# Altium schematic sheet 降压模块.SchDoc
size A4
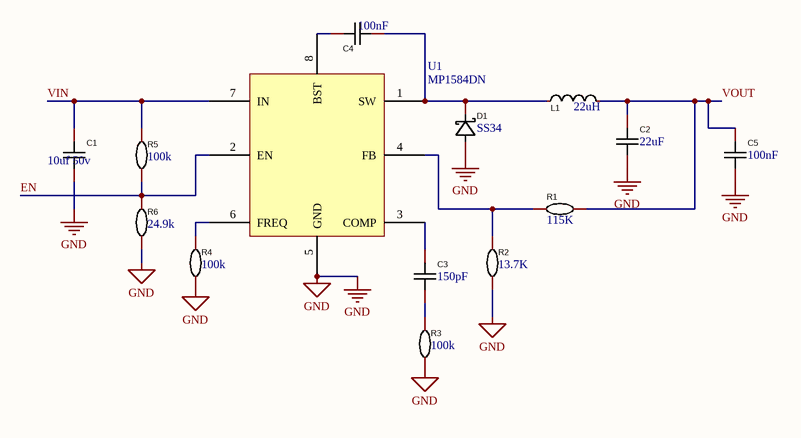
[diagram p0: 降压模块.SchDoc]

## Parts
C1  10uf 50v  [C1206]
C2  22uF  [C1206]
C3  150pF  [R0603]
C4  100nF  [R0603]
C5  100nF  [R0603]
D1  SS34  [ss34  SMA_L4.3-W2.5-LS5.0-RD]
L1  22uH  [功率电感15uh]
R1  115K  [R0603]
R2  13.7K  [R0603]
R3  100k  [R0603]
R4  100k  [R0603]
R5  100k  [R0603]
R6  24.9k  [R0603]
U1  MP1584DN  [LC-SOIC-8_EP_150mil]

## Nets
GND: C1.1 C2.1 C5.1 D1.2(A) R2.1 R3.1 R4.1 R6.1 U1.5(GND)
EN: R5.1 R6.2 U1.2(EN)
VIN: C1.2 R5.2 U1.7(IN)
VOUT: C2.2 C5.2 L1.2 R1.1
NetC3_1: C3.1 R3.2
NetC3_2: C3.2 U1.3(COMP)
NetC4_1: C4.1 U1.8(BST)
NetC4_2: C4.2 D1.1(C) L1.1 U1.1(SW)
NetR1_2: R1.2 R2.2 U1.4(FB)
NetR4_2: R4.2 U1.6(FREQ)

## Library data of the parts
C1 C3-C5 = 电容22uf 6.3v x7r: 型号： CGA5L1X7R0J226MT0Y0E / 品牌： TDK / 封装： 1206 / 描述：容值：22uF 精度：±20% 额定电压：6.3V 材质(温度系数)：X7R; Name: 22uF; Add into BOM: yes; Value: 22uF; Tolerance: ±20%; Voltage Rated: 6.3V; Temperature Coefficient: X7R; Symbol: CGA5L1X7R0J226MT0Y0E; Device: CGA5L1X7R0J226MT0Y0E; LCSC Part Name: 22uF ±20% 6.3V; Supplier Part: C342630; Manufacturer: TDK; Manufacturer Part: CGA5L1X7R0J226MT0Y0E; Supplier Footprint: 1206; JLCPCB Part Class: Extended Part; Datasheet: https://atta.szlcsc.com/upload/public/pdf/source/20190716/C342630_ADB15E5CCD286B86322CE8B53B7BBFDA.pdf; Supplier: LCSC; Convert to PCB: yes
C2 = 电容22uf 6.3v x7r: 1206; Manufacturer: TDK; Symbol: CGA5L1X7R0J226MT0Y0E; Add into BOM: yes; Tolerance: ±20%; Voltage Rated: 6.3V; Temperature Coefficient: X7R; Name: 22uF; Device: CGA5L1X7R0J226MT0Y0E; LCSC Part Name: 22uF ±20% 6.3V; Supplier Part: C342630; Manufacturer Part: CGA5L1X7R0J226MT0Y0E; Supplier Footprint: 1206; JLCPCB Part Class: Extended Part; Datasheet: https://atta.szlcsc.com/upload/public/pdf/source/20190716/C342630_ADB15E5CCD286B86322CE8B53B7BBFDA.pdf; Supplier: LCSC; Convert to PCB: yes; Value: 22uF
D1 = SS34: 型号： SS34 品牌： TWGMC(台湾迪嘉) 封装： SMA 二极管配置：独立式 直流反向耐压(Vr)：40V 平均整流电流(Io)：3A 正向压降(Vf)：550mV@3A 二极管配置：独立式 直流反向耐压(Vr)：40V 平均整流电流(Io)：3A 正向压降(Vf)：950mV@3A; Symbol: SS34_C727060; Add into BOM: yes; Diode Configuration: 独立式; Reverse Voltage (Vr): 40V; Average Rectified Current (Io): 3A; Reverse Leakage Current (Ir): 500uA@40V; Name: SS34; Device: SS34_C727060; LCSC Part Name: 40V 3A 550mV@3A; Supplier Part: C727060; Manufacturer: TWGMC(台湾迪嘉); Manufacturer Part: SS34; Supplier Footprint: SMA; JLCPCB Part Class: Extended Part; Datasheet: https://atta.szlcsc.com/upload/public/pdf/source/20200828/C727059_6599B6CAC5F3238B9C33E46794659DBE.pdf; Supplier: LCSC; Convert to PCB: yes; Forward Voltage (Vf@If): 550mV@3A
L1 = 功率电感 15uh: 能装上就行; Manufacturer: Sunlord(顺络); Manufacturer Part: MWSA1004S-150MT; Name: 15uH; Symbol: MWSA1004-150MT; Device: MWSA1004S-150MT_C151872; Add into BOM: yes; Value: 15uH; Tolerance: ±20%; Rated Current: 6.5A; Saturation Current (Isat): 7A; DC Resistance (DCR): 45mΩ; LCSC Part Name: 15uH ±20% 7A; Supplier Part: C151872; Supplier Footprint: SMD; JLCPCB Part Class: Extended Part; Datasheet: https://atta.szlcsc.com/upload/public/pdf/source/20180327/C151872_2907C77BE933212C728C209604192B1D.pdf; Supplier: LCSC; Convert to PCB: yes; Type: -; Ratings: -
R1-R6 = res: Manufacturer: FH(风华); Name: 210kΩ; Symbol: RS-03K2103FT; Add into BOM: yes; Value: 210kΩ; Tolerance: ±1%; Power(Watts): 100mW; Temperature Coefficient: ±100ppm/℃; Overload Voltage (Max): 50V; Device: RS-03K2103FT; LCSC Part Name: 210kΩ ±1% 100mW; Supplier Part: C304716; Manufacturer Part: RS-03K2103FT; Supplier Footprint: 0603; JLCPCB Part Class: Extended Part; Datasheet: https://atta.szlcsc.com/upload/public/pdf/source/20181008/C304716_9BC739B48A9CEB835AD69263E841A8EC.pdf; Supplier: LCSC; Convert to PCB: yes; Operating Temperature Range: -55℃~+155℃